# EAGLE schematic splitter (EAGLE 7.3.0)
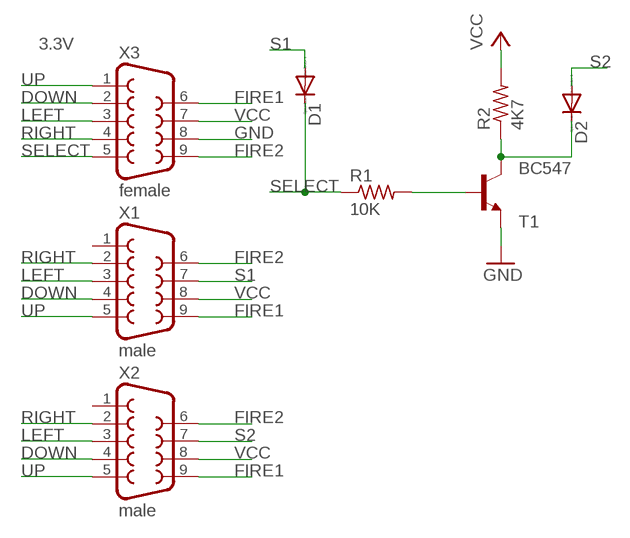
[diagram p0: schematic, sheet 1]

## Parts
D1  1N4148DO35-7  [DO35-7]
D2  1N4148DO35-7  [DO35-7]
R1  10K  R-US_0204/7  [0204/7]
R2  4K7  R-US_0204/7  [0204/7]
T1  BC547  [TO92]
X1  male  F09D  [F09D]
X2  male  F09D  [F09D]
X3  female  F09D  [F09D]

## Nets
DOWN: X1.4 X2.4 X3.2
FIRE1: X1.9 X2.9 X3.6
FIRE2: X1.6 X2.6 X3.9
GND: T1.1(E) X3.8
LEFT: X1.3 X2.3 X3.3
N$1: D2.C R2.1 T1.3(C)
N$2: R1.2 T1.2(B)
RIGHT: X1.2 X2.2 X3.4
S1: D1.A X1.7
S2: D2.A X2.7
SELECT: D1.C R1.1 X3.5
UP: X1.5 X2.5 X3.1
VCC: R2.2 X1.8 X2.8 X3.7
Unconnected: X1.1 X2.1

## Library data of the parts
D1 D2 = diode:1N4148: DIODE high speed (Philips)
R1 R2 = rcl:R-US_: RESISTOR, American symbol
T1 = transistor:BC547: NPN TRANSISTOR
X1-X3 = con-subd:F09: SUB-D; OC_FARNELL: unknown; OC_NEWARK: unknown